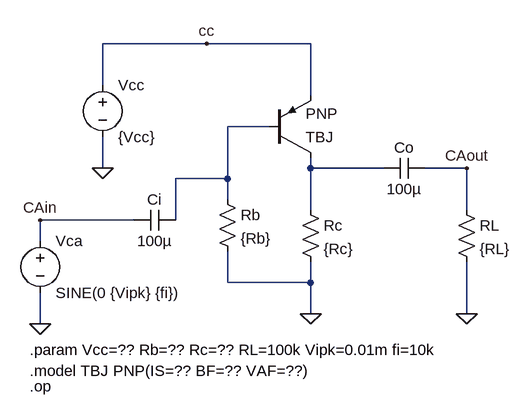
[diagram p0: schematic TBJ01bCAop.asc]
TBJ01bCAop.asc, the LTspice schematic file:
Version 4
SHEET 1 1608 1076
WIRE 128 -16 -32 -16
WIRE 288 -16 128 -16
WIRE -32 48 -32 -16
WIRE 288 64 288 -16
WIRE 224 112 160 112
WIRE -32 176 -32 128
WIRE 288 176 288 160
WIRE 400 176 288 176
WIRE 528 176 464 176
WIRE 160 192 160 112
WIRE 160 192 80 192
WIRE 160 224 160 192
WIRE 288 240 288 176
WIRE 528 240 528 176
WIRE 16 256 -128 256
WIRE 80 256 80 192
WIRE -128 288 -128 256
WIRE 160 352 160 304
WIRE 288 352 288 320
WIRE 288 352 160 352
WIRE 288 400 288 352
WIRE 528 400 528 320
WIRE -128 416 -128 368
FLAG -32 176 0
FLAG 288 400 0
FLAG -128 416 0
FLAG 128 -16 cc
FLAG -128 256 CAin
FLAG 528 400 0
FLAG 528 176 CAout
SYMBOL res 144 208 R0
SYMATTR InstName Rb
SYMATTR Value {Rb}
SYMBOL res 272 224 R0
SYMATTR InstName Rc
SYMATTR Value {Rc}
SYMBOL voltage -32 32 R0
WINDOW 123 0 0 Left 0
WINDOW 39 0 0 Left 0
SYMATTR InstName Vcc
SYMATTR Value {Vcc}
SYMBOL cap 80 240 R90
WINDOW 0 0 32 VBottom 2
WINDOW 3 32 32 VTop 2
SYMATTR InstName Ci
SYMATTR Value 100µ
SYMBOL cap 464 160 R90
WINDOW 0 0 32 VBottom 2
WINDOW 3 32 32 VTop 2
SYMATTR InstName Co
SYMATTR Value 100µ
SYMBOL voltage -128 272 R0
WINDOW 123 0 0 Left 0
WINDOW 39 0 0 Left 0
SYMATTR InstName Vca
SYMATTR Value SINE(0 {Vipk} {fi})
SYMBOL res 512 224 R0
SYMATTR InstName RL
SYMATTR Value {RL}
SYMBOL pnp 224 160 M180
SYMATTR InstName TBJ
TEXT -144 456 Left 2 !.param Vcc=?? Rb=?? Rc=?? RL=100k Vipk=0.01m fi=10k
TEXT -144 512 Left 2 !.op
TEXT -144 488 Left 2 !.model TBJ PNP(IS=?? BF=?? VAF=??)

The netlist it stands for:
* TBJ01bCAop.asc
Rb N001 0 {Rb}
Rc N002 0 {Rc}
Vcc cc 0 {Vcc}
Ci N001 CAin 100µ
Co CAout N002 100µ
Vca CAin 0 SINE(0 {Vipk} {fi})
RL CAout 0 {RL}
Q§TBJ N002 N001 cc 0 PNP
.model NPN NPN
.model PNP PNP
.lib standard.bjt
.param Vcc=?? Rb=?? Rc=?? RL=100k Vipk=0.01m fi=10k
.op
.model TBJ PNP(IS=?? BF=?? VAF=??)
.backanno
.end